# Altium schematic sheet MotorControl.SchDoc
size A4
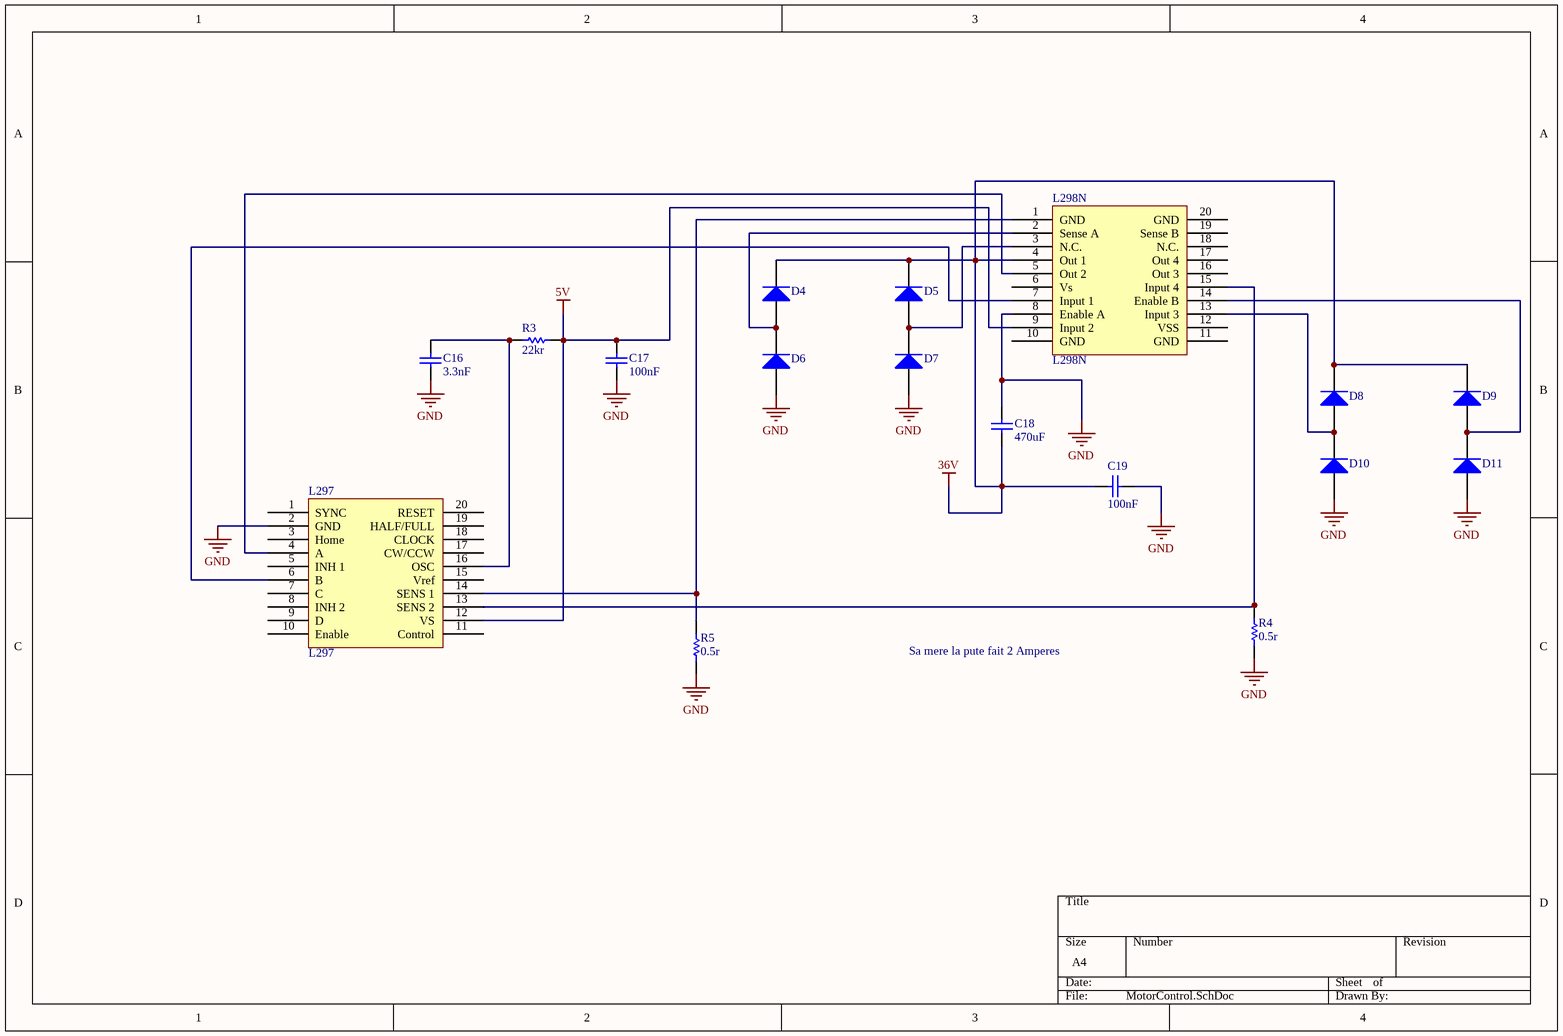
[diagram p0: MotorControl.SchDoc]

## Parts
C16  3.3nF  [CAPC2012N]
C17  100nF  [CAPC2012N]
C18  470uF  [CAPC2012N]
C19  100nF  [CAPC2012N]
D4  (no value)  [SMC]
D5  (no value)  [SMC]
D6  (no value)  [SMC]
D7  (no value)  [SMC]
D8  (no value)  [SMC]
D9  (no value)  [SMC]
D10  (no value)  [SMC]
D11  (no value)  [SMC]
L297  L297
L298N  L298N
R3  22kr  [AXIAL-0.3]
R4  0.5r  [AXIAL-0.3]
R5  0.5r  [AXIAL-0.3]

## Nets
5V: C17.2 L297.12(VS) L298N.9(Input_2) R3.1
36V: C18.2 C19.2 D4.2(K) D5.2(K) D8.2(K) D9.2(K) L298N.4(Out_1)
GND: C16.1 C17.1 C18.1 C19.1 D6.1(A) D7.1(A) D10.1(A) D11.1(A) L297.2(GND) L298N.8(Enable_A) R4.2 R5.2
NetC16_2: C16.2 L297.16(OSC) R3.2
NetD4_1: D4.1(A) D6.2(K) L298N.2(Sense_A)
NetD5_1: D5.1(A) D7.2(K) L298N.3(N.C.)
NetD8_1: D8.1(A) D10.2(K) L298N.13(Input_3)
NetD9_1: D9.1(A) D11.2(K) L298N.14(Enable_B)
NetL297_4: L297.4(A) L298N.5(Out_2)
NetL297_6: L297.6(B) L298N.7(Input_1)
NetL297_13: L297.13(SENS_2) L298N.15(Input_4) R4.1
NetL297_14: L297.14(SENS_1) L298N.1(GND) R5.1

Not connected (* = marked no-connect by the designer): L297 1(SYNC) 3(Home) 5(INH_1) 7(C) 8(INH_2) 9(D) 10(Enable) 11(Control) 15(Vref) 17(CW/CCW) 18(CLOCK) 19(HALF/FULL) 20(RESET); L298N 6(Vs) 10(GND) 11(GND) 12(VSS) 16(Out_3) 17(Out_4) 18(N.C.) 19(Sense_B) 20(GND)

## Notes on the sheet
- Sa mere la pute fait 2 Amperes

## Library data of the parts
C16-C19 = Cap: Capacitor; Fabricant: TDK; Fournisseur: Farnell; RefFabricant: C2012X5R0J106M/1.25; RefFournisseur: 2309029; Precision: 6,3V X5R; Published: 8-Jun-2000; LatestRevisionDate: 17-Jul-2002; LatestRevisionNote: Re-released for DXP Platform.; PackageReference: RAD-0.3; Publisher: Altium Limited; PackageDescription: Radial Cap, Thru-Hole; 2 Leads; 0.3 in Pin Spacing
  C16: Value: 3.3nF
  C17 C19: Value: 100nF
  C18: Value: 470uF
D4-D11 = Diode: Default Diode; Fabricant: VISHAY; Fournisseur: Farnell; RefFabricant: GF1A-E3/67A; RefFournisseur: 9549560; Published: 8-Jun-2000; LatestRevisionDate: 17-Jul-2002; LatestRevisionNote: Re-released for DXP Platform.; PackageVersion: Sep-1996; PackageReference: SMC; Publisher: Altium Limited; PackageDescription: DO-214-AB/SMC; 2 C-Bend Leads; Body 7.9 x 5.9 mm, inc. leads (LxW); Code_JEDEC: DO-214-AB
R3-R5 = Res1: Resistor; Precision: 1%; Published: 8-Jun-2000; LatestRevisionDate: 17-Jul-2002; LatestRevisionNote: Re-released for DXP Platform.; PackageReference: AXIAL-0.3; Publisher: Altium Limited; PackageDescription: Axial Device, Thru-Hole; 2 Leads; 0.3 in Pin Spacing
  R3: Value: 22kr
  R4 R5: Value: 0.5r